# Altium schematic sheet EOG_FRONT_END.SchDoc
size A4; SheetNumber: 1; SheetTotal: 4
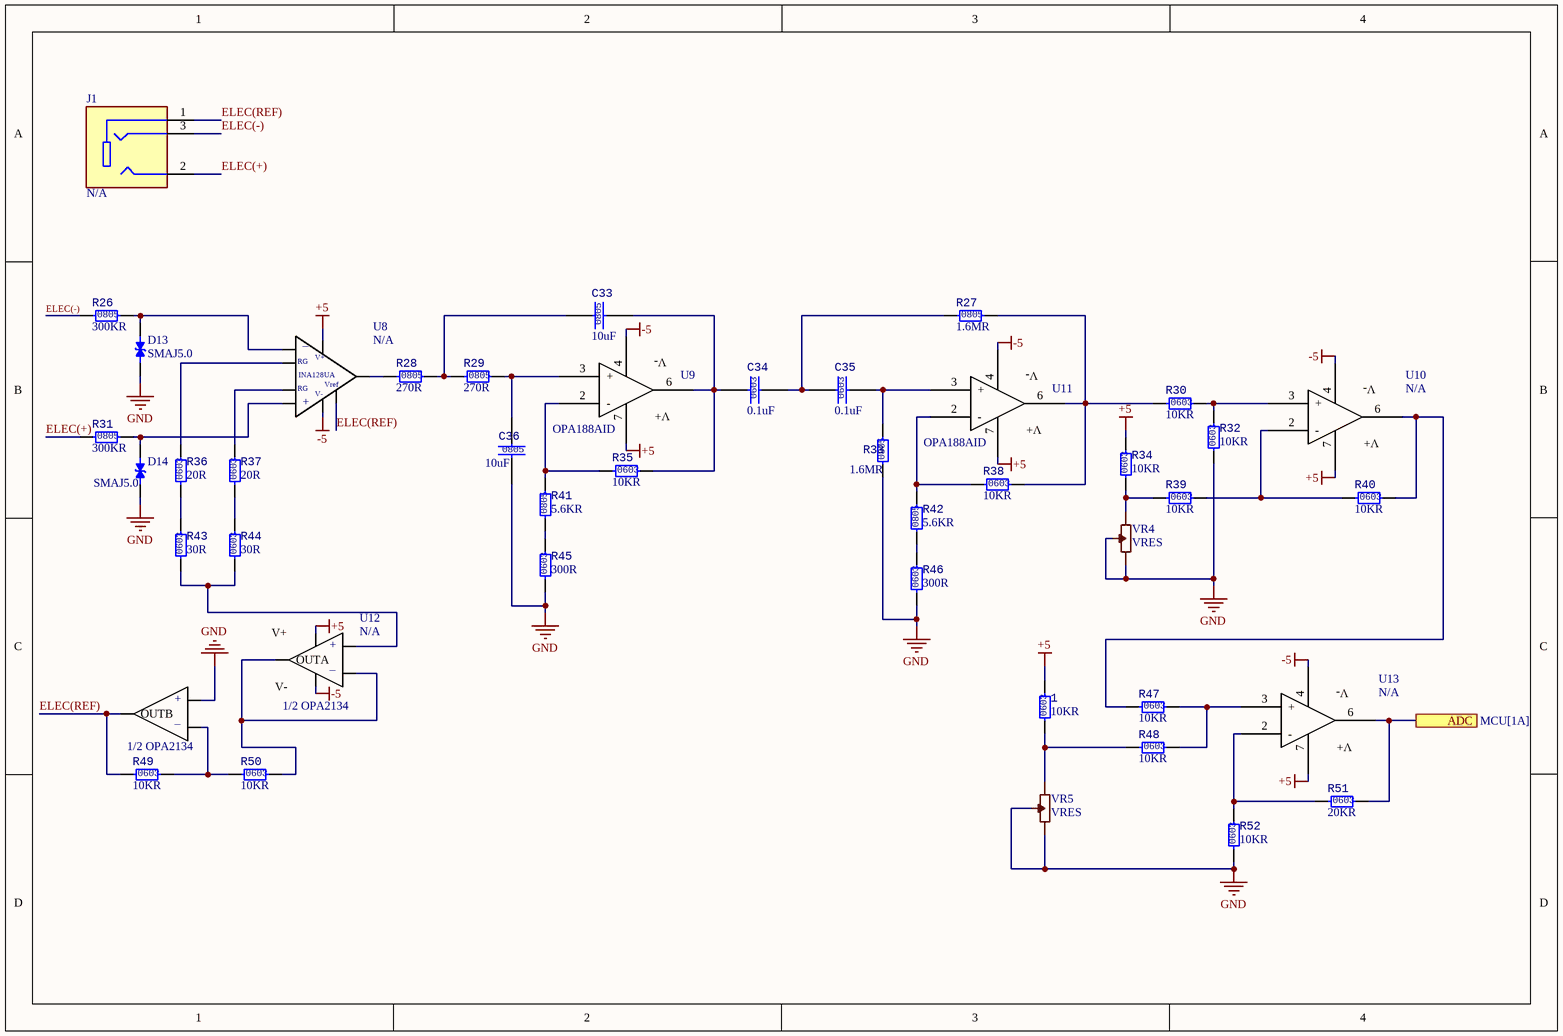
[diagram p0: EOG_FRONT_END.SchDoc]

## Parts
1  Size: 0603  [RESC 0603(1608) SMD]  (hidden comment: 10KR)
C33  Size: 0805  [CAPCER 0603 SMD]  (hidden comment: 10uF)
C34  Size: 0603  [CAPCER 0805 SMD]  (hidden comment: 0.1uF)
C35  Size: 0603  [CAPCER 0805 SMD]  (hidden comment: 0.1uF)
C36  Size: 0805  [CAPCER 0603 SMD]  (hidden comment: 10uF)
D13  SMAJ5.0
D14  SMAJ5.0
J1  JACK 3.5mm  [JACK_3.5]  (value not drawn)
R26  Size: 0805  [RESC 0805 SMD]  (hidden comment: 300KR)
R27  Size: 0805  [RESC 0805 SMD]  (hidden comment: 1.6MR)
R28  Size: 0805  [RESC 0805 SMD]  (hidden comment: 270R)
R29  Size: 0805  [RESC 0805 SMD]  (hidden comment: 270R)
R30  Size: 0603  [RESC 0603(1608) SMD]  (hidden comment: 10KR)
R31  Size: 0805  [RESC 0805 SMD]  (hidden comment: 300KR)
R32  Size: 0603  [RESC 0603(1608) SMD]  (hidden comment: 10KR)
R33  Size: 0805  [RESC 0805 SMD]  (hidden comment: 1.6MR)
R34  Size: 0603  [RESC 0603(1608) SMD]  (hidden comment: 10KR)
R35  Size: 0603  [RESC 0603(1608) SMD]  (hidden comment: 10KR)
R36  value 20R  Size: 0603  [RESC 0603(1608) SMD]  (hidden comment: 510R)
R37  value 20R  Size: 0603  [RESC 0603(1608) SMD]  (hidden comment: 510R)
R38  Size: 0603  [RESC 0603(1608) SMD]  (hidden comment: 10KR)
R39  Size: 0603  [RESC 0603(1608) SMD]  (hidden comment: 10KR)
R40  Size: 0603  [RESC 0603(1608) SMD]  (hidden comment: 10KR)
R41  Size: 0805  [RESC 0805 SMD]  (hidden comment: 5.6KR)
R42  Size: 0805  [RESC 0805 SMD]  (hidden comment: 5.6KR)
R43  value 30R  Size: 0603  [RESC 0603(1608) SMD]  (hidden comment: 12KR)
R44  value 30R  Size: 0603  [RESC 0603(1608) SMD]  (hidden comment: 12KR)
R45  Size: 0603  [RESC 0603(1608) SMD]  (hidden comment: 300R)
R46  Size: 0603  [RESC 0603(1608) SMD]  (hidden comment: 300R)
R47  Size: 0603  [RESC 0603(1608) SMD]  (hidden comment: 10KR)
R48  Size: 0603  [RESC 0603(1608) SMD]  (hidden comment: 10KR)
R49  Size: 0603  [RESC 0603(1608) SMD]  (hidden comment: 10KR)
R50  Size: 0603  [RESC 0603(1608) SMD]  (hidden comment: 10KR)
R51  value 20KR  Size: 0603  [RESC 0603(1608) SMD]  (hidden comment: 10KR)
R52  Size: 0603  [RESC 0603(1608) SMD]  (hidden comment: 10KR)
U8  INA128UA  [8-SOIC]  (value not drawn)
U9  OPA188AID  [8-SOIC]
U10  OPA188AID  [8-SOIC]  (value not drawn)
U11  OPA188AID  [8-SOIC]
U12  OPA2134UA  [8-SOIC]  (value not drawn)
U13  OPA188AID  [8-SOIC]  (value not drawn)
VR4  VRES
VR5  VRES

## Ports
ADC (see MCU[1A])

## Nets
+5: 1.2 R34.2 U8.7 U9.7(VCC) U10.7(VCC) U11.7(VCC) U12.8(V+) U13.7(VCC)
-5: U8.4 U9.4(GND) U10.4(GND) U11.4(GND) U12.4(V-) U13.4(GND)
GND: C36.2 D13.1 D14.1 R32.1 R33.1 R45.1 R46.1 R52.1 U12.5(INB(+)) VR4.1 VR4.2 VR5.1 VR5.2
ADC: R51.2 U13.6(OUT_1) ; port ADC
ELEC(+): J1.2 R31.1
ELEC(-): J1.3 R26.1
ELEC(REF): J1.1 R49.1 U8.5 U12.7(OUTB)
Net1_1: 1.1 R48.1 VR5.3
NetC33_1: C33.1 R28.2 R29.1
NetC33_2: C33.2 C34.1 R35.2 U9.6(OUT_1)
NetC34_2: C34.2 C35.1 R27.1
NetC35_2: C35.2 R33.2 U11.3(+)
NetC36_1: C36.1 R29.2 U9.3(+)
NetD13_2: D13.2 R26.2 U8.2
NetD14_2: D14.2 R31.2 U8.3
NetR27_2: R27.2 R30.1 R38.2 U11.6(OUT_1)
NetR28_1: R28.1 U8.6
NetR30_2: R30.2 R32.2 U10.3(+)
NetR34_1: R34.1 R39.1 VR4.3
NetR35_1: R35.1 R41.2 U9.2(-)
NetR36_1: R36.1 R43.2
NetR36_2: R36.2 U8.1
NetR37_1: R37.1 R44.2
NetR37_2: R37.2 U8.8
NetR38_1: R38.1 R42.2 U11.2(-)
NetR39_2: R39.2 R40.1 U10.2(-)
NetR40_2: R40.2 R47.1 U10.6(OUT_1)
NetR41_1: R41.1 R45.2
NetR42_1: R42.1 R46.2
NetR43_1: R43.1 R44.1 U12.2(INA(+))
NetR47_2: R47.2 R48.2 U13.3(+)
NetR49_2: R49.2 R50.1 U12.6(INB(-))
NetR50_2: R50.2 U12.1(OUTA) U12.3(INA(-))
NetR51_1: R51.1 R52.2 U13.2(-)

## Notes on the sheet
- (in symbol DB-0014) V-; V+
- (in symbol DB-0015) _; V+; RG; Vref; V-; +
- (in symbol DB-0029) +; _; 1/2 OPA2134

## Library data of the parts
1 R30 R32 R34 R35 R38-R40 R47-R52 = DB-0003: RESISTOR SMD 10KR OHM 1% 100mW 0603; Power Rate: 100mW; Design Item ID: DB-0003; Type: RESISTOR; Tolerance: 1%; Footprint Type: SMD; Supplier: THEGIOIIC; Supplier Part Number: Điện Trở 10 KOhm 0603 1%; Supplier Link: https://www.thegioiic.com/dien-tro-10-kohm-0603-1-
  1 R30 R32 R34 R35 R38-R40 R47-R50 R52: Value: 10KR
C33 C36 = DB-0018: CAPACITOR SMD 10uF 25V 10% 0805; Design Item ID: DB-0018; Value: 10uF; Type: CAPACITOR; Power Rate: N/A; Tolerance: 10%; Footprint Type: SMD; Supplier: THEGIOIIC; Supplier Part Number: Tụ Gốm 0805 10uF 25V; Supplier Link: https://www.thegioiic.com/tu-gom-0805-10uf-25v
C34 C35 = DB-0017: CAPACITOR SMD 0.1uF 50V 10% 0603; Design Item ID: DB-0017; Value: 0.1uF; Type: CAPACITOR; Power Rate: N/A; Tolerance: 10%; Footprint Type: SMD; Supplier: THEGIOIIC; Supplier Part Number: Tụ Gốm 0603 100nF (0.1uF) 25V; Supplier Link: https://www.thegioiic.com/tu-gom-0603-100nf-0-1uf-25v
D13 D14 = DB-0021: Design Item ID: DB-0021
J1 = DB-0053: Jack Audio 3.5mm PJ-320D PJ320D Hàn Board chân dán; Value: N/A; Type: CONNECTOR; Power Rate: N/A; Tolerance: N/A; Footprint Type: SMD; Size: SMD; Supplier: Điện tử Minh Nguyên; Supplier Part Number: Jack Audio 3.5mm PJ-320D PJ320D Hàn Board chân dán; Supplier Link: https://chipn24.com/g30-jack-audio-3-5mm-pj-320d-pj320d-han-board-chan-dan-id2179.html; Design Item ID: DB-0053
R26 R31 = DB-0016: RESISTOR SMD 300KR OHM 5% 125mW 0805; Power Rate: 125mW; Design Item ID: DB-0016; Value: 300KR; Type: RESISTOR; Tolerance: 5%; Footprint Type: SMD; Supplier: THEGIOIIC; Supplier Part Number: Điện Trở 300 KOhm 0805 5%; Supplier Link: https://www.thegioiic.com/dien-tro-300-kohm-0805-5-
R27 R33 = DB-0025: RESISTOR SMD 1.6MR OHM 5% 125mW 0805; Power Rate: 125mW; Design Item ID: DB-0025; Value: 1.6MR; Type: RESISTOR; Tolerance: 5%; Footprint Type: SMD; Supplier: THEGIOIIC; Supplier Part Number: Điện Trở 1.6 KOhm 0805 5%; Supplier Link: https://www.thegioiic.com/dien-tro-1-6-kohm-0805-5-
R28 R29 = DB-0022: RESISTOR SMD 270R OHM 5% 125mW 0805; Power Rate: 125mW; Design Item ID: DB-0022; Value: 270R; Type: RESISTOR; Tolerance: 5%; Footprint Type: SMD; Supplier: THEGIOIIC; Supplier Part Number: Điện Trở 270 Ohm 0805 5%; Supplier Link: https://www.thegioiic.com/dien-tro-270-ohm-0805-5-
R36 R37 = DB-0028: RESISTOR SMD 510R OHM 1% 100mW 0603; Power Rate: 100mW; Design Item ID: DB-0028; Type: RESISTOR; Tolerance: 1%; Footprint Type: SMD; Supplier: THEGIOIIC; Supplier Part Number: Điện Trở 510 Ohm 0603 1%; Supplier Link: https://www.thegioiic.com/dien-tro-510-ohm-0603-1-
R41 R42 = DB-0023: RESISTOR SMD 5.6KR OHM 1% 125mW 0805; Power Rate: 125mW; Design Item ID: DB-0023; Value: 5.6KR; Type: RESISTOR; Tolerance: 1%; Footprint Type: SMD; Supplier: THEGIOIIC; Supplier Part Number: Điện Trở 5.6 KOhm 0805 1%; Supplier Link: https://www.thegioiic.com/dien-tro-5-6-kohm-0805-1-
R43 R44 = DB-0027: RESISTOR SMD 12KR OHM 1% 100mW 0603; Power Rate: 100mW; Design Item ID: DB-0027; Type: RESISTOR; Tolerance: 1%; Footprint Type: SMD; Supplier: THEGIOIIC; Supplier Part Number: Điện Trở 12 KOhm 0603 1%; Supplier Link: https://www.thegioiic.com/dien-tro-12-kohm-0603-1-
R45 R46 = DB-0024: RESISTOR SMD 300R OHM 1% 125mW 0603; Power Rate: 125mW; Design Item ID: DB-0024; Value: 300R; Type: RESISTOR; Tolerance: 1%; Footprint Type: SMD; Supplier: THEGIOIIC; Supplier Part Number: Điện Trở 300 Ohm 0603 1%; Supplier Link: https://www.thegioiic.com/dien-tro-300-ohm-0603-1-
U8 = DB-0015: Instrumentation Amplifier 1 Circuit 8-SOIC; Design Item ID: DB-0015; Value: N/A; Type: IC; Power Rate: N/A; Tolerance: N/A; Footprint Type: SMD; Size: 8-SOIC; Supplier: DIGIKEY; Supplier Part Number: INA128UA; Supplier Link: https://www.digikey.com/en/products/detail/texas-instruments/INA128UA/300997
U9-U11 U13 = DB-0014: Zero-Drift Amplifier 1 Circuit Rail-to-Rail 8-SOIC; Design Item ID: DB-0014; Type: IC; Power Rate: N/A; Tolerance: N/A; Footprint Type: SMD; Size: 8-SOIC; Supplier: DIGIKEY; Supplier Part Number: OPA188AID; Supplier Link: https://www.digikey.com/en/products/detail/texas-instruments/OPA188AID/4146941
  U9 U11: Value: OPA188AID
  U10 U13: Value: N/A
U12 = DB-0029: IC AUDIO 2 CIRCUIT 8SOIC; Design Item ID: DB-0029; Value: N/A; Type: IC; Power Rate: N/A; Tolerance: N/A; Footprint Type: SMD; Size: 8-SOIC; Supplier: DIGIKEY; Supplier Part Number: IC AUDIO 2 CIRCUIT 8SOIC; Supplier Link: https://www.digikey.com/en/products/detail/texas-instruments/OPA2134UA
VR4 VR5 = DB-0026: Design Item ID: DB-0026